# EAGLE schematic 12V-to-5V-Converter (EAGLE 7.2.0)
The 2-transistor Black regulator App a02; +5v output, good all round https://romanblack.com/smps/a02.htm
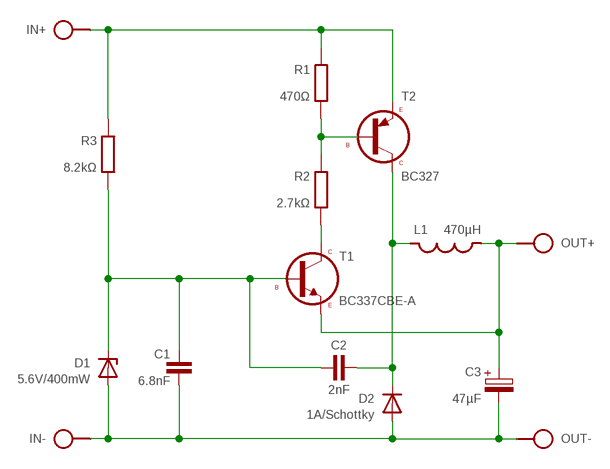
[diagram p0: schematic, sheet 1]

## Parts
C1  6.8nF  C025-050X050  [C025-050X050]
C2  2nF  C-H050-020X044  [C050-020X044]
C3  47µF  CPOLE2,5-5/V  [E2,5-5/V]
D1  5.6V/400mW  Z-DIODE34Z10V  [DO34Z10V]
D2  1A/Schottky  DIODE35-10  [DO35-10]
IN  SPAD+-+-  [SPAD+-]
L1  470µH  L-H-SHORT-03/10-X  [ED16]
OUT  SPAD+--+  [SPAD-+]
R1  470Ω  R0204/10-V  [0204/10-V]
R2  2.7kΩ  R0204/10-V  [0204/10-V]
R3  8.2kΩ  R0204/10-V  [0204/10-V]
T1  BC337CBE-A  [TO92-CBE-A]
T2  BC327  [TO92]

## Nets
N$1: C2.2 D2.C L1.2 T2.1(C)
N$2: C3.+ L1.1 OUT.2 T1.3(E)
N$3: C1.2 C3.- D1.A D2.A IN.1 OUT.1
N$4: C1.1 C2.1 D1.C R3.2 T1.2(B)
N$5: IN.2 R1.1 R3.1 T2.3(E)
N$6: R1.2 R2.1 T2.2(B)
N$7: R2.2 T1.1(C)

## Library data of the parts
C1 = c:C: CAPACITOR, European symbol
C2 = c:C-H
C3 = c:CPOL: POLARIZED CAPACITOR, European symbol
D1 = d:Z-DIODE
D2 = d:DIODE
IN OUT = pad:SPAD+-
L1 = l:L-H-SHORT
R1-R3 = r:R: RESISTOR, European symbol
T1 = t:BC337
T2 = t:BC327